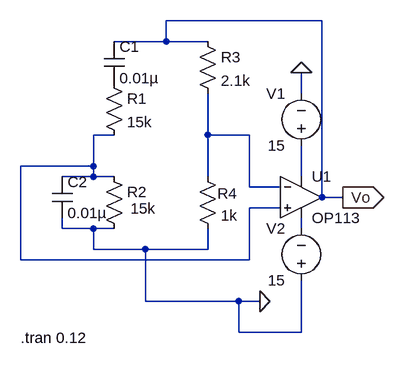
[diagram p0: schematic wienbridge.asc]
wienbridge.asc, the LTspice schematic file:
Version 4
SHEET 1 880 680
WIRE 416 -112 176 -112
WIRE 176 -80 176 -112
WIRE 176 -80 96 -80
WIRE 240 -80 176 -80
WIRE 384 0 384 -32
WIRE 96 64 64 64
WIRE 240 64 240 0
WIRE 304 64 240 64
WIRE 64 112 64 64
WIRE 64 112 -48 112
WIRE 64 128 64 112
WIRE 64 128 16 128
WIRE 96 128 64 128
WIRE 240 128 240 64
WIRE 384 128 384 80
WIRE 304 144 304 64
WIRE 352 144 304 144
WIRE 416 160 416 -112
WIRE 448 160 416 160
WIRE 352 176 304 176
WIRE 16 208 16 192
WIRE 64 208 16 208
WIRE 96 208 64 208
WIRE 384 208 384 192
WIRE 64 240 64 208
WIRE 144 240 64 240
WIRE 240 240 240 208
WIRE 240 240 144 240
WIRE -48 256 -48 112
WIRE 304 256 304 176
WIRE 304 256 -48 256
WIRE 144 320 144 240
WIRE 288 320 144 320
WIRE 320 320 288 320
WIRE 288 368 288 320
WIRE 384 368 384 288
WIRE 384 368 288 368
FLAG 320 320 0
FLAG 384 -32 0
FLAG 448 160 Vo
IOPIN 448 160 Out
SYMBOL res 80 -32 R0
SYMATTR InstName R1
SYMATTR Value 15k
SYMBOL res 224 -96 R0
SYMATTR InstName R3
SYMATTR Value 2.1k
SYMBOL res 80 112 R0
WINDOW 3 41 65 Left 2
SYMATTR Value 15k
SYMATTR InstName R2
SYMBOL res 224 112 R0
WINDOW 0 31 42 Left 2
SYMATTR InstName R4
SYMATTR Value 1k
SYMBOL cap 80 -80 R0
SYMATTR InstName C1
SYMATTR Value 0.01µ
SYMBOL cap 0 128 R0
SYMATTR InstName C2
SYMATTR Value 0.01µ
SYMBOL voltage 384 96 R180
WINDOW 0 24 96 Left 2
WINDOW 3 24 16 Left 2
SYMATTR InstName V1
SYMATTR Value 15
SYMBOL voltage 384 304 R180
WINDOW 0 24 96 Left 2
WINDOW 3 24 16 Left 2
SYMATTR InstName V2
SYMATTR Value 15
SYMBOL OpAmps\\OP113 384 96 R0
SYMATTR InstName U1
TEXT -48 376 Left 2 !.tran 0.12

The netlist it stands for:
* wienbridge.asc
R1 P001 N001 15k
R3 Vo N002 2.1k
R2 N001 0 15k
R4 N002 0 1k
C1 Vo P001 0.01µ
C2 N001 0 0.01µ
V1 N003 0 15
V2 0 N004 15
XU1 N001 N002 N003 N004 Vo OP113  ; pins In+ In- V+ V- OUT
.tran 0.12
.lib ADI.lib
.backanno
.end